# Altium schematic sheet DSP.SchDoc: Title
size 396 x 279 mm; PageSetup: Record=PageOptions|CenterHorizontal=True|CenterVertical=True|PrintScale=1.00|XCorrection=1.00|YCorrection=1.00|PrintKind=0|BorderSize=5000000|LeftOffset=0|BottomOffset=0|Orientation=2|PaperLength=1000|PaperWidth=1000|Scale=100|PaperSource=7|PrintQuality=-4|MediaType=1|DitherType=10|PaperKind=A3|PrintScaleMode=0
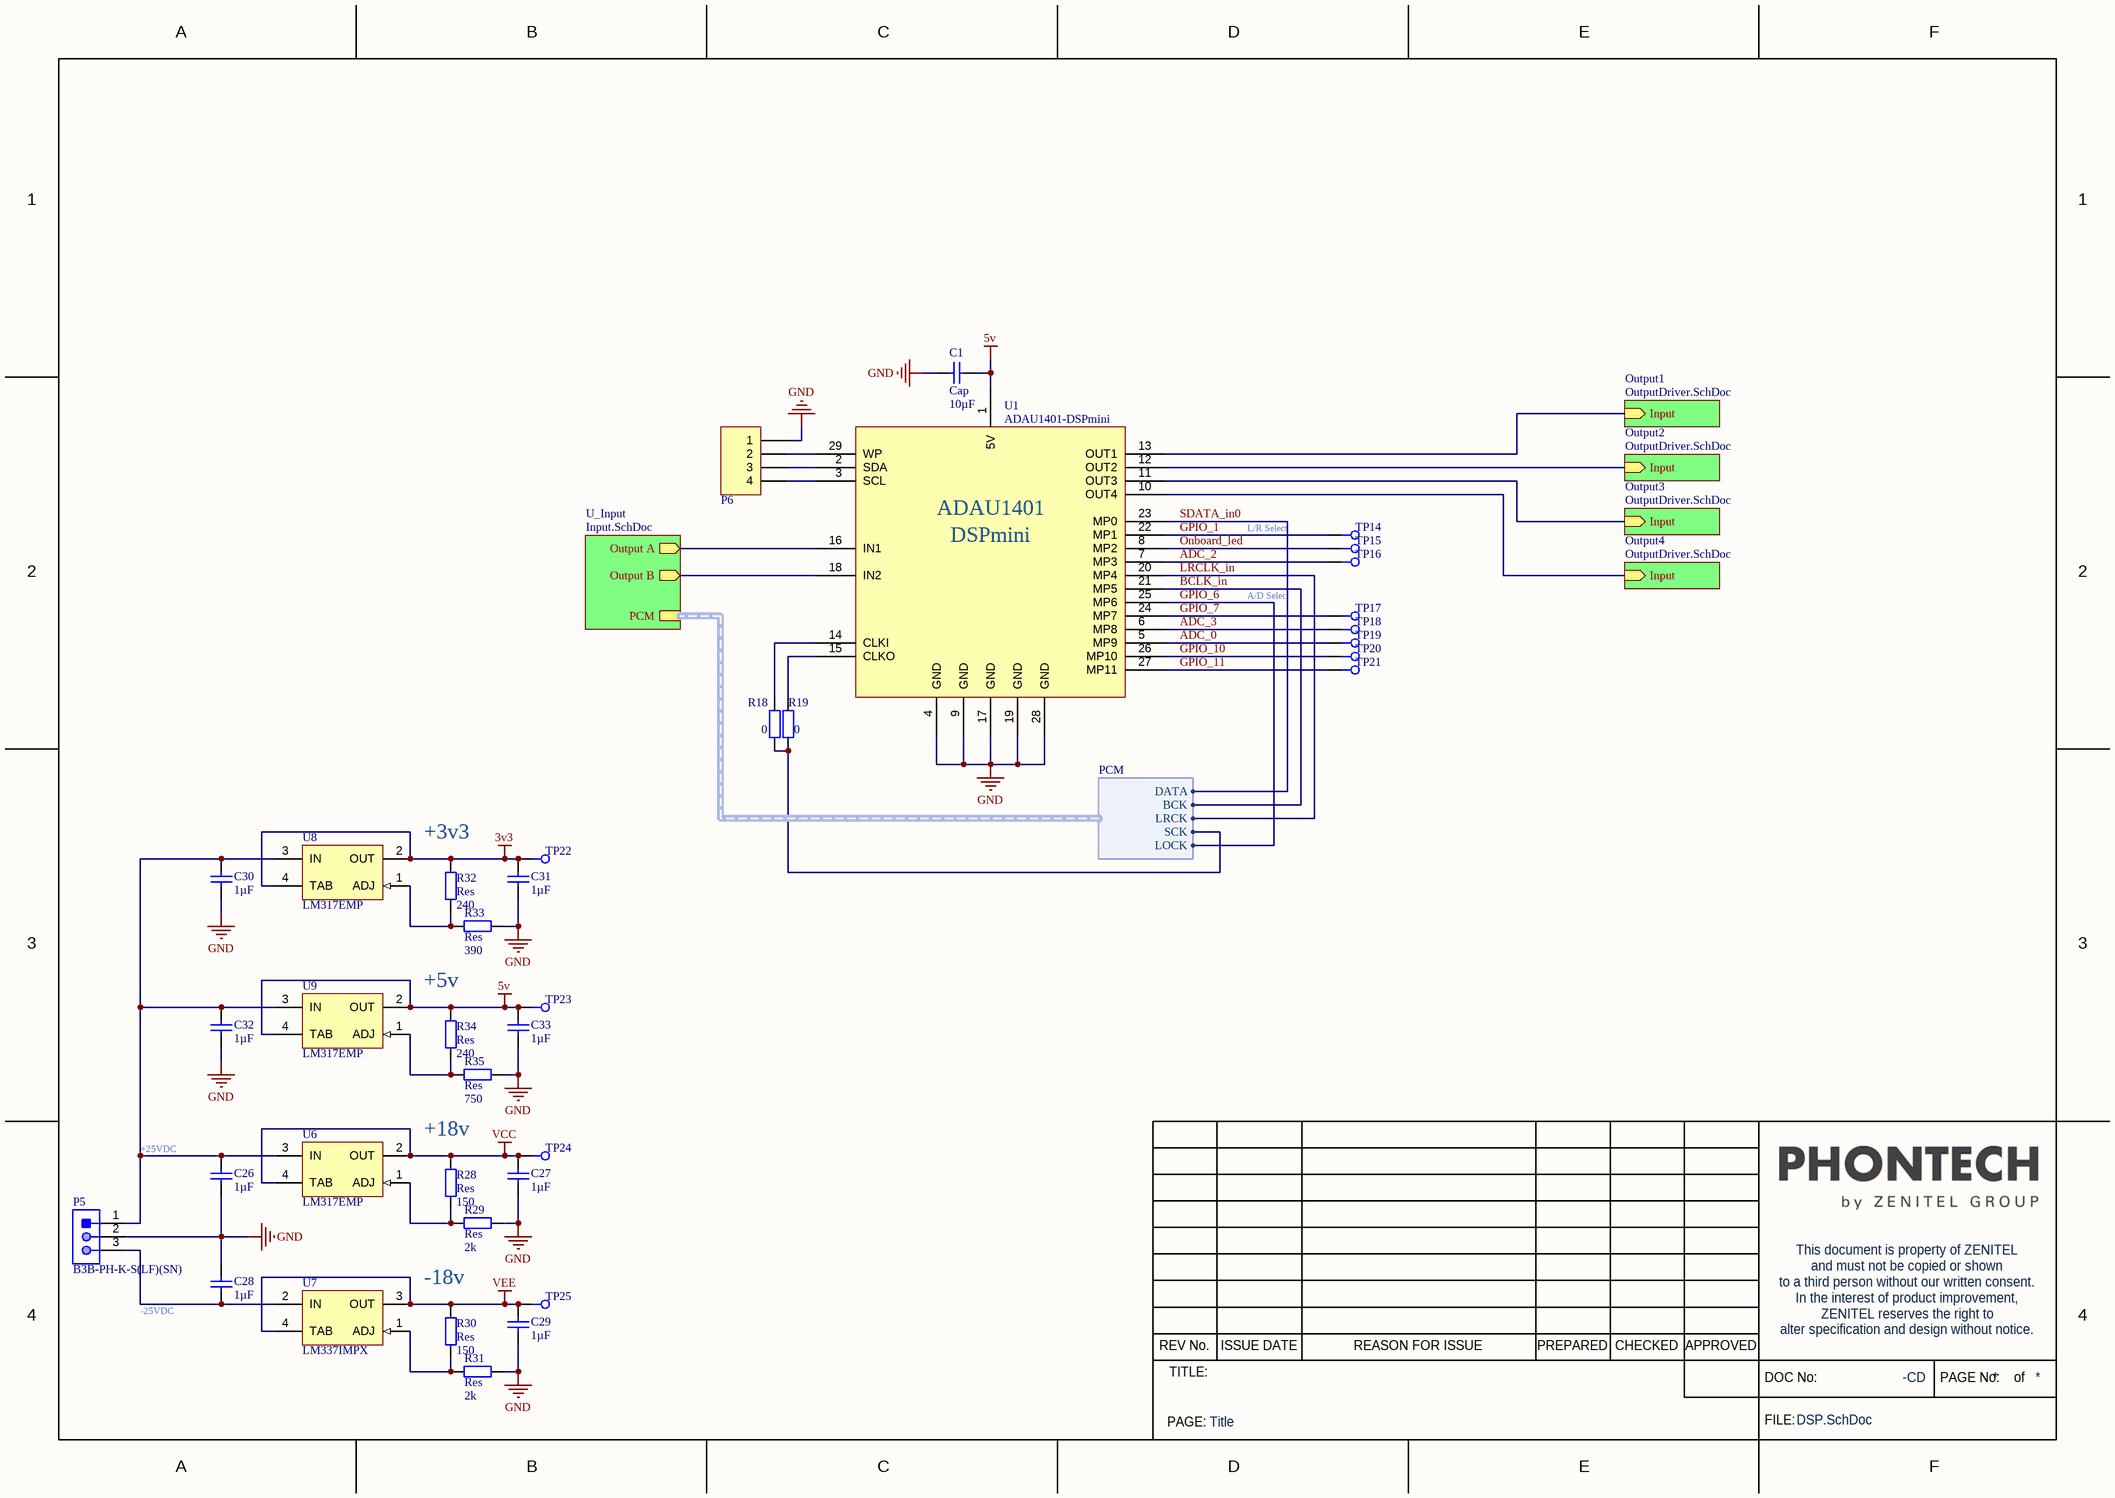
[diagram p0: DSP.SchDoc]

## Parts
C1  Cap  value 10µF  [CAPC2013X140X50NL20T25]
C26  value 1µF  [CAPC3225N]  (hidden comment: Cap)
C27  value 1µF  [CAPC3225N]  (hidden comment: Cap)
C28  value 1µF  [CAPC3225N]  (hidden comment: Cap)
C29  value 1µF  [CAPC3225N]  (hidden comment: Cap)
C30  value 1µF  [CAPC3225N]  (hidden comment: Cap)
C31  value 1µF  [CAPC3225N]  (hidden comment: Cap)
C32  value 1µF  [CAPC3225N]  (hidden comment: Cap)
C33  value 1µF  [CAPC3225N]  (hidden comment: Cap)
P5  B3B-PH-K-S(LF)(SN)  [JST-B3B-PH-K-S-3_V]
P6  Header 4  [TSW-104-14-S-S]  (value not drawn)
R18  value 0  [RESC3216X60X45NL10T20]  (hidden comment: Res)
R19  value 0  [RESC3216X60X45NL10T20]  (hidden comment: Res)
R28  Res  value 150  [RESC1005X40X25NL05T05]
R29  Res  value 2k  [RESC1005X40X25NL05T05]
R30  Res  value 150  [RESC1005X40X25NL05T05]
R31  Res  value 2k  [RESC1005X40X25NL05T05]
R32  Res  value 240  [RESC1005X40X25NL05T05]
R33  Res  value 390  [RESC1005X40X25NL05T05]
R34  Res  value 240  [RESC1005X40X25NL05T05]
R35  Res  value 750  [RESC1005X40X25NL05T05]
TP14  TP Ø1.0MM  [TP_1MM]  (value not drawn)  (no BOM)
TP15  TP Ø1.0MM  [TP_1MM]  (value not drawn)  (no BOM)
TP16  TP Ø1.0MM  [TP_1MM]  (value not drawn)  (no BOM)
TP17  TP Ø1.0MM  [TP_1MM]  (value not drawn)  (no BOM)
TP18  TP Ø1.0MM  [TP_1MM]  (value not drawn)  (no BOM)
TP19  TP Ø1.0MM  [TP_1MM]  (value not drawn)  (no BOM)
TP20  TP Ø1.0MM  [TP_1MM]  (value not drawn)  (no BOM)
TP21  TP Ø1.0MM  [TP_1MM]  (value not drawn)  (no BOM)
TP22  TP Ø1.0MM  [TP_1MM]  (value not drawn)  (no BOM)
TP23  TP Ø1.0MM  [TP_1MM]  (value not drawn)  (no BOM)
TP24  TP Ø1.0MM  [TP_1MM]  (value not drawn)  (no BOM)
TP25  TP Ø1.0MM  [TP_1MM]  (value not drawn)  (no BOM)
U1  ADAU1401-DSPmini  [ADAU1401-DSPmini]
U6  LM317EMP  [SOT223-4N]
U7  LM337IMPX  [DCY0004A_N]
U8  LM317EMP  [SOT223-4N]
U9  LM317EMP  [SOT223-4N]

## Sub-sheets
Output1 = OutputDriver.SchDoc: Input (in)
Output2 = OutputDriver.SchDoc: Input (in)
Output3 = OutputDriver.SchDoc: Input (in)
Output4 = OutputDriver.SchDoc: Input (in)
U_Input = Input.SchDoc: Output A (out), Output B (out), PCM (harness PCM)

## Harnesses
PCM: DATA, BCK, LRCK, SCK, LOCK

## Nets
3v3: C31.2 R32.2 TP22.1 U8.2(OUT) U8.4(TAB)
5v: C1.2 C33.2 R34.2 TP23.1 U1.1(5V) U9.2(OUT) U9.4(TAB)
GND: C1.1 C26.1 C27.1 C28.2 C29.1 C30.1 C31.1 C32.1 C33.1 P5.2 P6.1 R29.1 R31.1 R33.2 R35.2 U1.4(GND) U1.9(GND) U1.17(GND) U1.19(GND) U1.28(GND)
VCC: C27.2 R28.2 TP24.1 U6.2(OUT) U6.4(TAB)
VEE: C29.2 R30.2 TP25.1 U7.3(OUT) U7.4(TAB)
ADC_0: TP19.1 U1.5(MP9)
ADC_2: TP16.1 U1.7(MP3)
ADC_3: TP18.1 U1.6(MP8)
BCLK_in: U1.21(MP5) ; sheet U_Input/PCM.BCK
GPIO_1: TP14.1 U1.22(MP1)
GPIO_6: U1.25(MP6) ; sheet U_Input/PCM.LOCK
GPIO_7: TP17.1 U1.24(MP7)
GPIO_10: TP20.1 U1.26(MP10)
GPIO_11: TP21.1 U1.27(MP11)
LRCLK_in: U1.20(MP4) ; sheet U_Input/PCM.LRCK
Onboard_led: TP15.1 U1.8(MP2)
SDATA_in0: U1.23(MP0) ; sheet U_Input/PCM.DATA
NetC26_2: C26.2 C30.2 C32.2 P5.1 U6.3(IN) U8.3(IN) U9.3(IN)
NetC28_1: C28.1 P5.3 U7.2(IN)
NetP6_2: P6.2 U1.29(WP)
NetP6_3: P6.3 U1.2(SDA)
NetP6_4: P6.4 U1.3(SCL)
NetR18_1: R18.1 U1.14(CLKI)
NetR18_2: R18.2 R19.2 ; sheet U_Input/PCM.SCK
NetR19_1: R19.1 U1.15(CLKO)
NetR28_1: R28.1 R29.2 U6.1(ADJ)
NetR30_1: R30.1 R31.2 U7.1(ADJ)
NetR32_1: R32.1 R33.1 U8.1(ADJ)
NetR34_1: R34.1 R35.1 U9.1(ADJ)
NetU1_10: U1.10(OUT4) ; sheet Output4/Input
NetU1_11: U1.11(OUT3) ; sheet Output3/Input
NetU1_12: U1.12(OUT2) ; sheet Output2/Input
NetU1_13: U1.13(OUT1) ; sheet Output1/Input
NetU1_16: U1.16(IN1) ; sheet U_Input/Output A
NetU1_18: U1.18(IN2) ; sheet U_Input/Output B

## Notes on the sheet
- L/R Select
- A/D Select
- +3v3
- +5v
- +25VDC
- +18v
- -25VDC
- -18v
- A
- B
- C
- D
- E
- F
- 1
- 2
- 3
- ZENITEL reserves the right to
- In the interest of product improvement,
- to a third person without our written consent.
- and must not be copied or shown
- This document is property of ZENITEL
- 4
- TITLE:
- REV No.
- ISSUE DATE
- REASON FOR ISSUE
- PREPARED
- CHECKED
- APPROVED
- DOC No:
- -CD
- alter specification and design without notice.
- PAGE No:
- of
- PAGE:
- FILE:
- (in symbol ADAU1401-DSPmini) ADAU1401; DSPmini

## Library data of the parts
C1 = CMP-CAP-00199-6: CR0805 10u 10V X7R 10% h=1.25mm; Zenitel PartNumber: 4000060821; Capacitor Type: Ceramic; Tolerance: 10%; Case/Package: 0805; Mount: SMD; Dielectric: X7R; Voltage: 10V; Pins: 2; RoHS: Yes
C26-C33 = CMP-CAP-00478-3: Chip cap 1uF 50v X7R 1210; Zenitel PartNumber: 4000084277; Tolerance: 10%; Capacitor Type: Ceramic; Case/Package: 1210; Dielectric: X7R; Voltage: 50V; Mount: SMD
P5 = CMP-2000-05164-1: Male Header, Pitch 2 mm, 1 x 3 Position, Height 6 mm, Tail Length 3.4 mm, -25 to 85 degC, RoHS, Bulk; Manufacturer: JST; Style/Orientation: StraightHeader/Plug; Pitch: 2mm; No of Positions: 3; Termination: Crimp; Manufacturer URL: http://www.jst.com/home2.html; Datasheet Version: Oct-06; Type: ShroudedHeader; Datasheet URL: https://datasheet.ciiva.com/11746/0900766b80826550-11746939.pdf
P6 = CMP-CON-00726-1: 4 Pin straight header; Zenitel PartNumber: 4000097756; Pitch: 2.54mm; Rows: 1; Mount: HOLE; Type: Header; Pins: 4; Series: TSW-series; Angle: Straight
R18 R19 = CMP-RES-00440-3: 0R 1206; Zenitel PartNumber: 4000085059; Power: 250mW; Tolerance: 0%; Case/Package: 1206; Mount: SMD
R28 R30 = CMP-RES-00033-4: Chip resistor 150R - 0402; Zenitel PartNumber: 4000081078; Tolerance: 1%; Power: 62.5mW; Voltage: 50V; Case/Package: 0402; Pins: 2; Mount: SMD; RoHS: Yes
R29 R31 = CMP-RES-00834-5: Chip resistor 2k 1% - 0402; Zenitel PartNumber: EGSMD80417; Voltage: 50V; Power: 63mW; Tolerance: 1%; Mount: SMT; RoHS: Yes; Pins: 2; Case/Package: 0402
R32 R34 = CMP-RES-01185-4: Chip resistor 240R 1% - 0402; Zenitel PartNumber: EGSMD80322; Voltage: 50V; Power: 63mW; Pins: 2; RoHS: Yes; Tolerance: 1%; Mount: SMT; Case/Package: 0402
R33 = CMP-RES-00038-4: Chip resistor 390R - 0402; Zenitel PartNumber: 4000081083; Tolerance: 5%; Power: 62.5mW; Voltage: 50V; Case/Package: 0402; Pins: 2; RoHS: Yes; Mount: SMD
R35 = CMP-RES-01205-4: Chip resistor 750R 1% - 0402; Zenitel PartNumber: EGSMD80353; Voltage: 50V; Power: 63mW; Mount: SMT; Pins: 2; RoHS: Yes; Tolerance: 1%; Case/Package: 0402
TP14-TP25 = CMP-ELMEC-00015-2: Test Point, copper pad, 1.0mm diameter; Type: TP; RoHS: Yes; Mount: SMD; Case/Package: Ø1mm
U6 U8 U9 = CMP-IC-00203-1: LM317EMP SOT223; Zenitel PartNumber: 4000084254; Mount: SMD
U7 = CMP-0062-01833-3: 3-Terminal Adjustable Negative Regulator, 4-pin SOT-223; Manufacturer: Texas Instruments; CompType: LDO IC; PowerWise: N; PackageTopMarking: XYTT*N02A; Code_IPC: SOT223-4; RoHS: N; PinCount: 4; PackageReference: DCY0004A; PackageDescription: Molded SOT-223, 6.50 x 3.56 x 1.6mm Body, 4 Lead, 2.3mm Pitch; ComponentLink1URL: http://www.ti.com/general/docs/lit/getliterature.tsp?genericPartNumber=LM337-N&fileType=pdf; ComponentLink1Description: Datasheet URL; Code_JEDEC: TO-261-AA